# EAGLE design schematic (EAGLE 7.1.0)
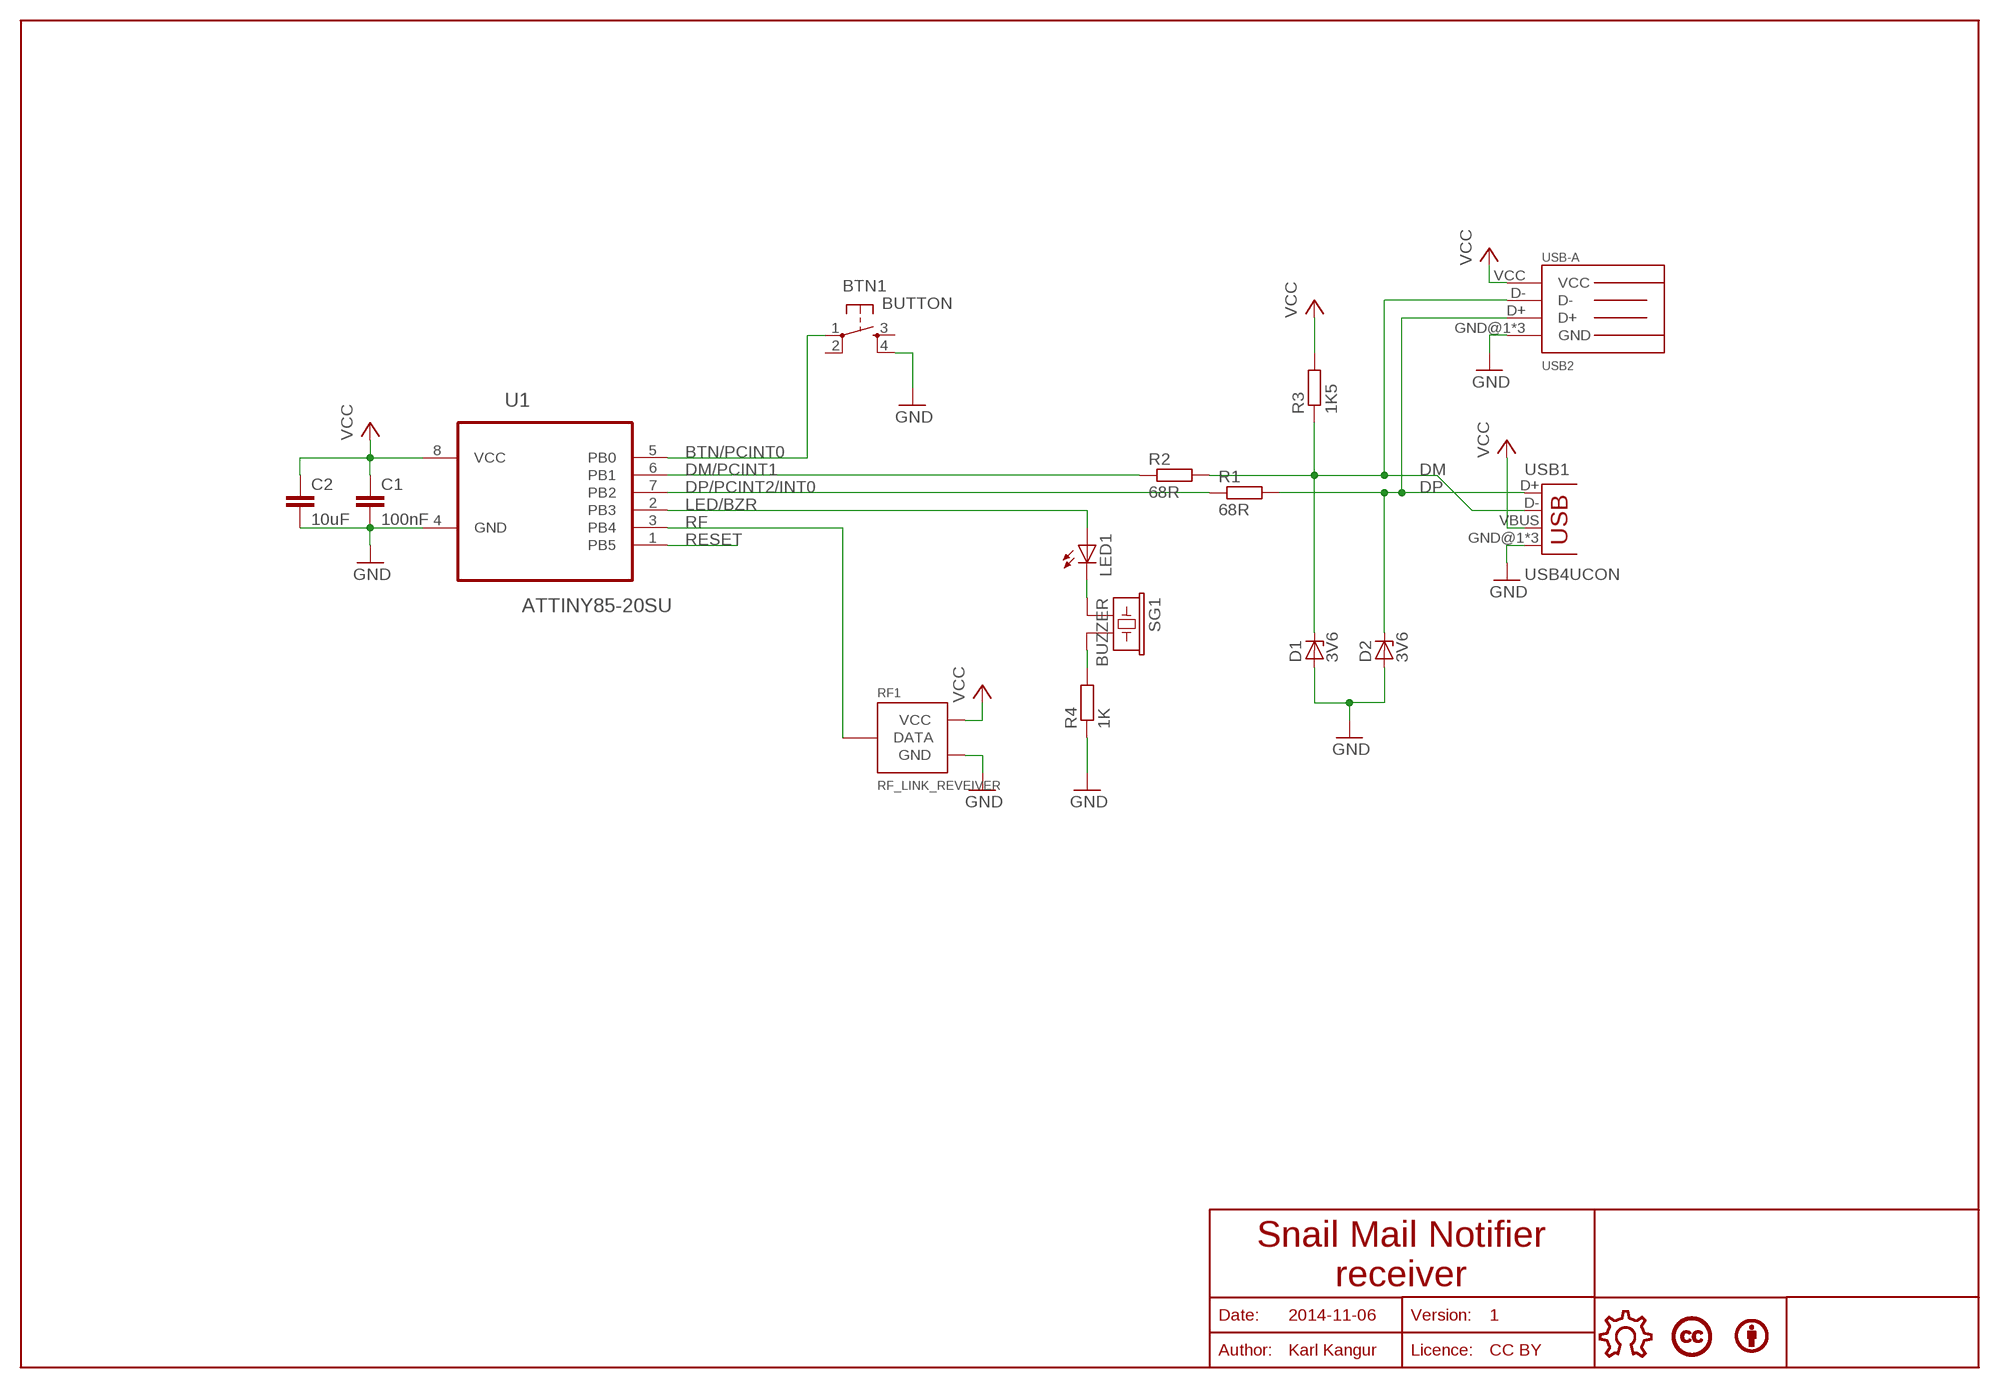
[diagram p0: schematic, sheet 1]

## Parts
BTN1  BUTTON  [BUTTON]
BY1  BYBOTTOM  [BY]
C1  100nF  C-EUC0805  [C0805]
C2  10uF  C-EUC0805  [C0805]
D1  3V6  ZENER-DIODESOD80C  [SOD80C]
D2  3V6  ZENER-DIODESOD80C  [SOD80C]
LED1  LEDCHIP-LED0805  [CHIP-LED0805]
LICENCE1  LICENCECC-BOTTOM  [CREATIVE-COMMONS]
R1  68R  R-EU_R0805  [R0805]
R2  68R  R-EU_R0805  [R0805]
R3  1K5  R-EU_R0805  [R0805]
R4  1K  R-EU_R0805  [R0805]
RF1  RF_LINK_REVEIVER  [RF_LINK_REVEIVER]
SG1  BUZZER  [PS1240P02BT]
U1  ATTINY85-20SU  [SOIC127P798X216-8N]
U$5  OPEN-HARDWARE-LOGOBOTTOM-SMALL  [OPEN-HARDWARE-BOTTOM-SMALL]
USB1  USB4UCON  [USB-MICROB-4UCON]
USB2  USB-A  [USB-A]

## Nets
BTN/PCINT0: BTN1.1 U1.5(PB0)
DM: D1.C R2.2 R3.1 USB1.D- USB2.D-
DM/PCINT1: R2.1 U1.6(PB1)
DP: D2.C R1.2 USB1.D+ USB2.D+
DP/PCINT2/INT0: R1.1 U1.7(PB2)
GND: BTN1.4 C1.2 C2.2 D1.A D2.A R4.1 RF1.GND U1.4(GND) USB1.GND@1(GND) USB1.GND@4(GND) USB1.GND@5(GND) USB2.GND@1(GND) USB2.GND@2(GND) USB2.GND@3(GND)
LED/BZR: LED1.A U1.2(PB3)
N$1: R4.2 SG1.P$2
N$2: LED1.C SG1.P$1
RESET: U1.1(PB5)
RF: RF1.DATA@1(DATA) RF1.DATA@2(DATA) U1.3(PB4)
VCC: C1.1 C2.1 R3.2 RF1.VCC U1.8(VCC) USB1.VBUS USB2.VCC
Unconnected: BTN1.2 BTN1.3

## Notes on the sheet
- Snail Mail Notifier
  receiver
- Date: | 2014-11-06 | Version: | 1
- Author: | Karl Kangur | Licence: | CC BY

## Library data of the parts
BTN1 = karl_new:BUTTON
BY1 = robopoly:BY
C1 C2 = rcl:C-EU: CAPACITOR, European symbol
D1 D2 = diode:ZENER-DIODE: Z-Diode
LED1 = led:LED: LED OSRAM: - CHIPLED LG R971, LG N971, LY N971, LG Q971, LY Q971, LO R971, LY R971 LH N974, LH R974 LS Q976, LO Q976, LY Q976 LO Q996 - Hyper CHIPLED LW Q18S LB Q993, LB Q99A, LB R99A - SideLED LS A670, LO A670, LY A670, LG A670, LP A670 LB A673, LV A673, LT A673, LW A673 LH A674 LY A675 LS A676, LA A676, LO A676, LY A676, LW A676 LS A679, LY A679, LG A679 - Hyper Micro SIDELED® LS Y876, LA Y876, LO Y876, LY Y876 LT Y87S - SmartLED LW L88C, LW L88S LB L89C, LB L89S, LG L890 LS L89K, LO L89K, LY L89K LS L896, LA L896, LO L896, LY L896 - TOPLED LS T670, LO T670, LY T670, LG T670, LP T670 LSG T670, LSP T670, LSY T670, LOP T670, LYG T670 LG T671, LOG T671, LSG T671 LB T673, LV T673, LT T673, LW T673 LH T674 LS T676, LA T676, LO T676, LY T676, LB T676, LH T676, LSB T676, LW T676 LB T67C, LV T67C, LT T67C, LS T67K, LO T67K, LY T67K, LW E67C LS E67B, LA E67B, LO E67B, LY E67B, LB E67C, LV E67C, LT E67C LW T67C LS T679, LY T679, LG T679 LS T770, LO T770, LY T770, LG T770, LP T770 LB T773, LV T773, LT T773, LW T773 LH T774 LS E675, LA E675, LY E675, LS T675 LS T776, LA T776, LO T776, LY T776, LB T776 LHGB T686 LT T68C, LB T68C - Hyper Mini TOPLED® LB M676 - Mini TOPLED Santana® LG M470 LS M47K, LO M47K, LY M47K Source: http://www.osram.convergy.de LUXEON: - LUMILED® LXK2-PW12-R00, LXK2-PW12-S00, LXK2-PW14-U00, LXK2-PW14-V00 LXK2-PM12-R00, LXK2-PM12-S00, LXK2-PM14-U00 LXK2-PE12-Q00, LXK2-PE12-R00, LXK2-PE12-S00, LXK2-PE14-T00, LXK2-PE14-U00 LXK2-PB12-K00, LXK2-PB12-L00, LXK2-PB12-M00, LXK2-PB14-N00, LXK2-PB14-P00, LXK2-PB14-Q00 LXK2-PR12-L00, LXK2-PR12-M00, LXK2-PR14-Q00, LXK2-PR14-R00 LXK2-PD12-Q00, LXK2-PD12-R00, LXK2-PD12-S00 LXK2-PH12-R00, LXK2-PH12-S00 LXK2-PL12-P00, LXK2-PL12-Q00, LXK2-PL12-R00 Source: www.luxeon.com KINGBRIGHT: KA-3528ASYC Source: www.kingbright.com
LICENCE1 = robopoly:LICENCE
R1-R4 = resistor:R-EU_: RESISTOR, European symbol; SPICEPREFIX: R
RF1 = robopoly:RF_LINK_REVEIVER
SG1 = robopoly:BUZZER: BUZZER Source: Buerklin; OC_FARNELL: unknown; OC_NEWARK: unknown
U1 = Atmel_By_element14_Batch_1:ATTINY85-20SU: 8-bit Microcontroller with In-System Programmable Flash; MPN: ATTINY85-20SU; OC_FARNELL: 1455164; OC_NEWARK: 58M3797; PACKAGE: SOIC-8; SUPPLIER: Atmel
U$5 = robopoly:OPEN-HARDWARE-LOGO
USB1 = robopoly:USB
USB2 = karl_new:USB-A

## Board
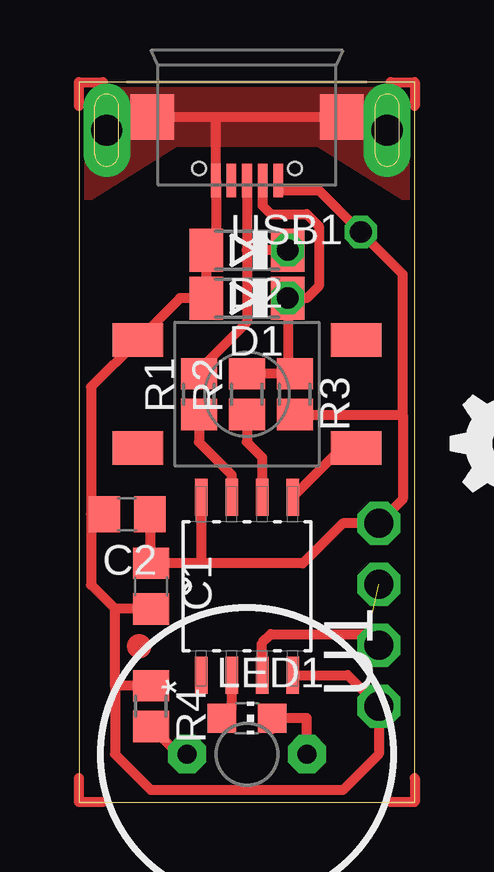
[diagram p1: board, top side]
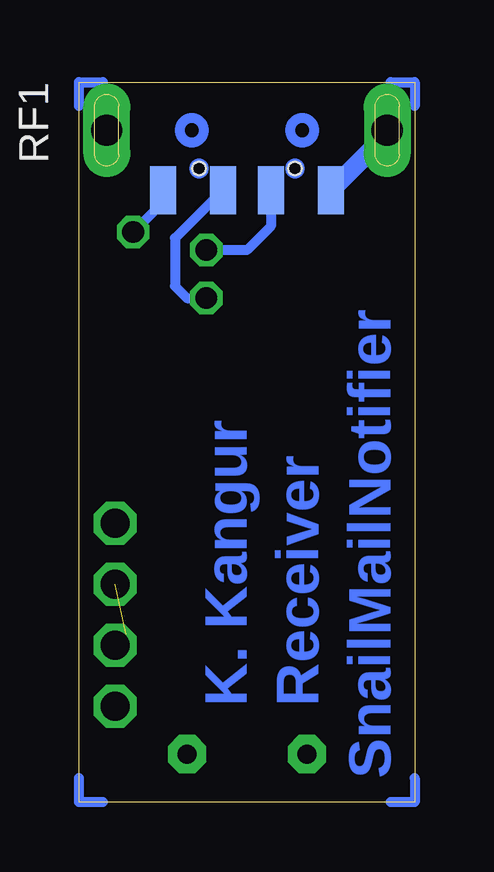
[diagram p2: board, bottom side, seen from below]

Size 14 x 30 mm. Coordinates in mm from the lower left corner, seen from the top.
Outline: 0,0 14,0 14,30 0,30 0,0
Copper layers (1*16): Top 0.035mm / dielectric 1.5mm / Bottom 0.035mm
Design rules "default *": minimum track width 10mil, minimum drill 24mil, track to track 8mil, track to pad 8mil, pad to pad 8mil, via to via 8mil, smd to smd 8mil, copper to edge 8mil, drill to drill 8mil, minimum pad ring 10mil, minimum via ring 8mil, stop-mask expansion 4mil, vias tented up to drill 0mil, thermal gap 10mil

### Footprints (pad centres in the part's own frame; a part is rotated, then mirrored left to right if it is on the bottom)
BUTTON = smd 1.4 x 2.1: 1 2.25,4.55; 2 2.25,-4.55; 3 -2.25,4.55; 4 -2.25,-4.55
C0805 = smd 1.3 x 1.5: 1 -0.95,0; 2 0.95,0
SOD80C = smd 1.4 x 1.8: A 1.7,0; C -1.7,0
CHIP-LED0805 = smd 1.2 x 1.2: A 0,-1.05; C 0,1.05
R0805 = smd 1.3 x 1.5: 1 -0.85,0; 2 0.85,0
RF_LINK_REVEIVER = drill 1.2 octagon: DATA@1 23.46,1.5; DATA@2 20.92,1.5; GND 26,1.5; VCC 18.38,1.5
PS1240P02BT = drill 0.8 pad 1.6 octagon: P$1 -2.5,0; P$2 2.5,0
SOIC127P798X216-8N = smd 1.549 x 0.533: 1 -3.708,1.905; 2 -3.708,0.635; 3 -3.708,-0.635; 4 -3.708,-1.905; 5 3.708,-1.905; 6 3.708,-0.635; 7 3.708,0.635; 8 3.708,1.905
USB-MICROB-4UCON = smd 0.4 x 1.4: D+ 0,4.1; D- -0.65,4.1; GND@1 1.3,4.1; ID 0.65,4.1; VBUS -1.3,4.1 | smd 1.8 x 1.9: GND@4 -3.95,1.45; GND@5 3.95,1.45 | hole 0.55: -2,3.6; 2,3.6
USB-A = smd 1.1 x 2: D+ -1,2.5; D- 1,2.5; GND@1 -3.5,2.5; VCC 3.5,2.5 | drill 1.3 long: GND@2 -5.85,0; GND@3 5.85,0

### Placement (x,y rotation side)
BTN1  7,17 270 top
BY1  30,15 0 bottom  (outside the outline)
C1  3,9 270 top
C2  2,12 180 top
D1  7,21 180 top
D2  7,23 180 top
LED1  7,3.5 270 top
LICENCE1  24,15 0 bottom  (outside the outline)
R1  5,17 90 top
R2  7,17 90 top
R3  9,17 270 top
R4  3,4 270 top
RF1  14,30 270 bottom
SG1  7,2 180 top
U1  7,9 90 top
U$5  18,15 0 bottom  (outside the outline)
USB1  7,30 180 top
USB2  7,28 180 bottom

### Tracks (layer width: path | path; a pad name or v marks a point on that pad's centre or on a via)
BTN/PCINT0
  Top 0.406: U1.5 10.95,14.75 BTN1.1
DM  (via drill 0.9)
  Top 0.406: USB1.D- 7.65,24.85 8,24.5 9.5,24.5 10,24 10,21.5 9.5,21 D1.C 8.7,18.15 R3.1 R2.2
  Bottom 0.406: 8,26 USB2.D- 10,23.5 10,21.5 9.5,21 D1.C
  other vias: 8.7,21
DM/PCINT1
  Top 0.406: R2.1 7,15 7.63,14.37 U1.6
DP  (via drill 0.9)
  Top 0.406: 7,23 7,20 5,18 R1.2 | USB1.D+ 7,23 | D2.C 7,23
  Bottom 0.406: USB2.D+ 6,24 7,23 D2.C
  other vias: 8.7,23
DP/PCINT2/INT0
  Top 0.406: R1.1 5,15 6.37,13.63 U1.7
GND
  Top 0.406: C1.2 1.5,8.05 | 1.5,4.85 1.5,8.05 | 0.5,12 0.5,17.3 BTN1.4 4.2,21 D1.A D2.A 5.7,23.4 USB1.GND@1 5.7,28.55 | 0.5,12 0.5,9.05 1.5,8.05 | C2.2 0.5,12 | USB1.GND@5 5.7,28.55 | 5.7,28.55 USB1.GND@4 | U1.4 11.21,5.29 RF1.GND 12.5,2 11,0.5 3,0.5 1.5,2 1.5,4.85 | R4.1 1.5,4.85
  Bottom 0.813: USB2.GND@1 1.15,27.85 USB2.GND@2
  pour Top (no thermals): 0,30 14,30 14,25 10,27.5 4,27.5 0,25
LED/BZR
  Top 0.406: 6.37,5.5 U1.2 6.37,3.92 LED1.A
N$1
  Top 0.406: R4.2 4.15,2 SG1.P$2
N$2
  Top 0.406: 8.05,3.05 LED1.C 9.5,3.5 SG1.P$1
N$5
  Top 0.406: 0,29 0,30 1,30
N$6
  Top 0.406: 13,30 14,30 14,29
N$7
  Top 0.406: 14,1 14,0 13,0
N$8
  Top 0.406: 1,0 0,0 0,1
N$9
  Bottom 0.406: 0,1 0,0 1,0
N$10
  Bottom 0.406: 13,0 14,0 14,1
N$11
  Bottom 0.406: 1,30 0,30 0,29
N$12
  Bottom 0.406: 14,29 14,30 13,30
RF  (1 unrouted)
  Top 0.406: RF1.DATA@1 12.04,7 8,7 7.63,6.63 U1.3
VCC  (via drill 0.9)
  Top 0.406: 5.09,9.95 C1.1 2.95,10 C2.1 | USB1.VBUS 8.3,25.5 10,25.5 v11.75,23.75 13.5,22 13.5,16.15 | U1.8 5.09,9.95 | 5.09,9.95 9.33,9.95 11,11.62 RF1.VCC 13.5,12.62 13.5,16.15 | R3.2 13.5,16.15
  Bottom 0.406: v11.75,23.75 10.5,25 USB2.VCC
(copper drawn outside any net)
  shapes: Bottom circle x4, Top circle x1

### Text on the board
Bottom: Receiver | K. Kangur | SnailMailNotifier
Document: Snail Mail Notifier receiver | Version: 1 | 2014-11-06 | Author: Karl Kangur | Licence: CC-BY